# EAGLE design untitled (EAGLE 9.6.2)
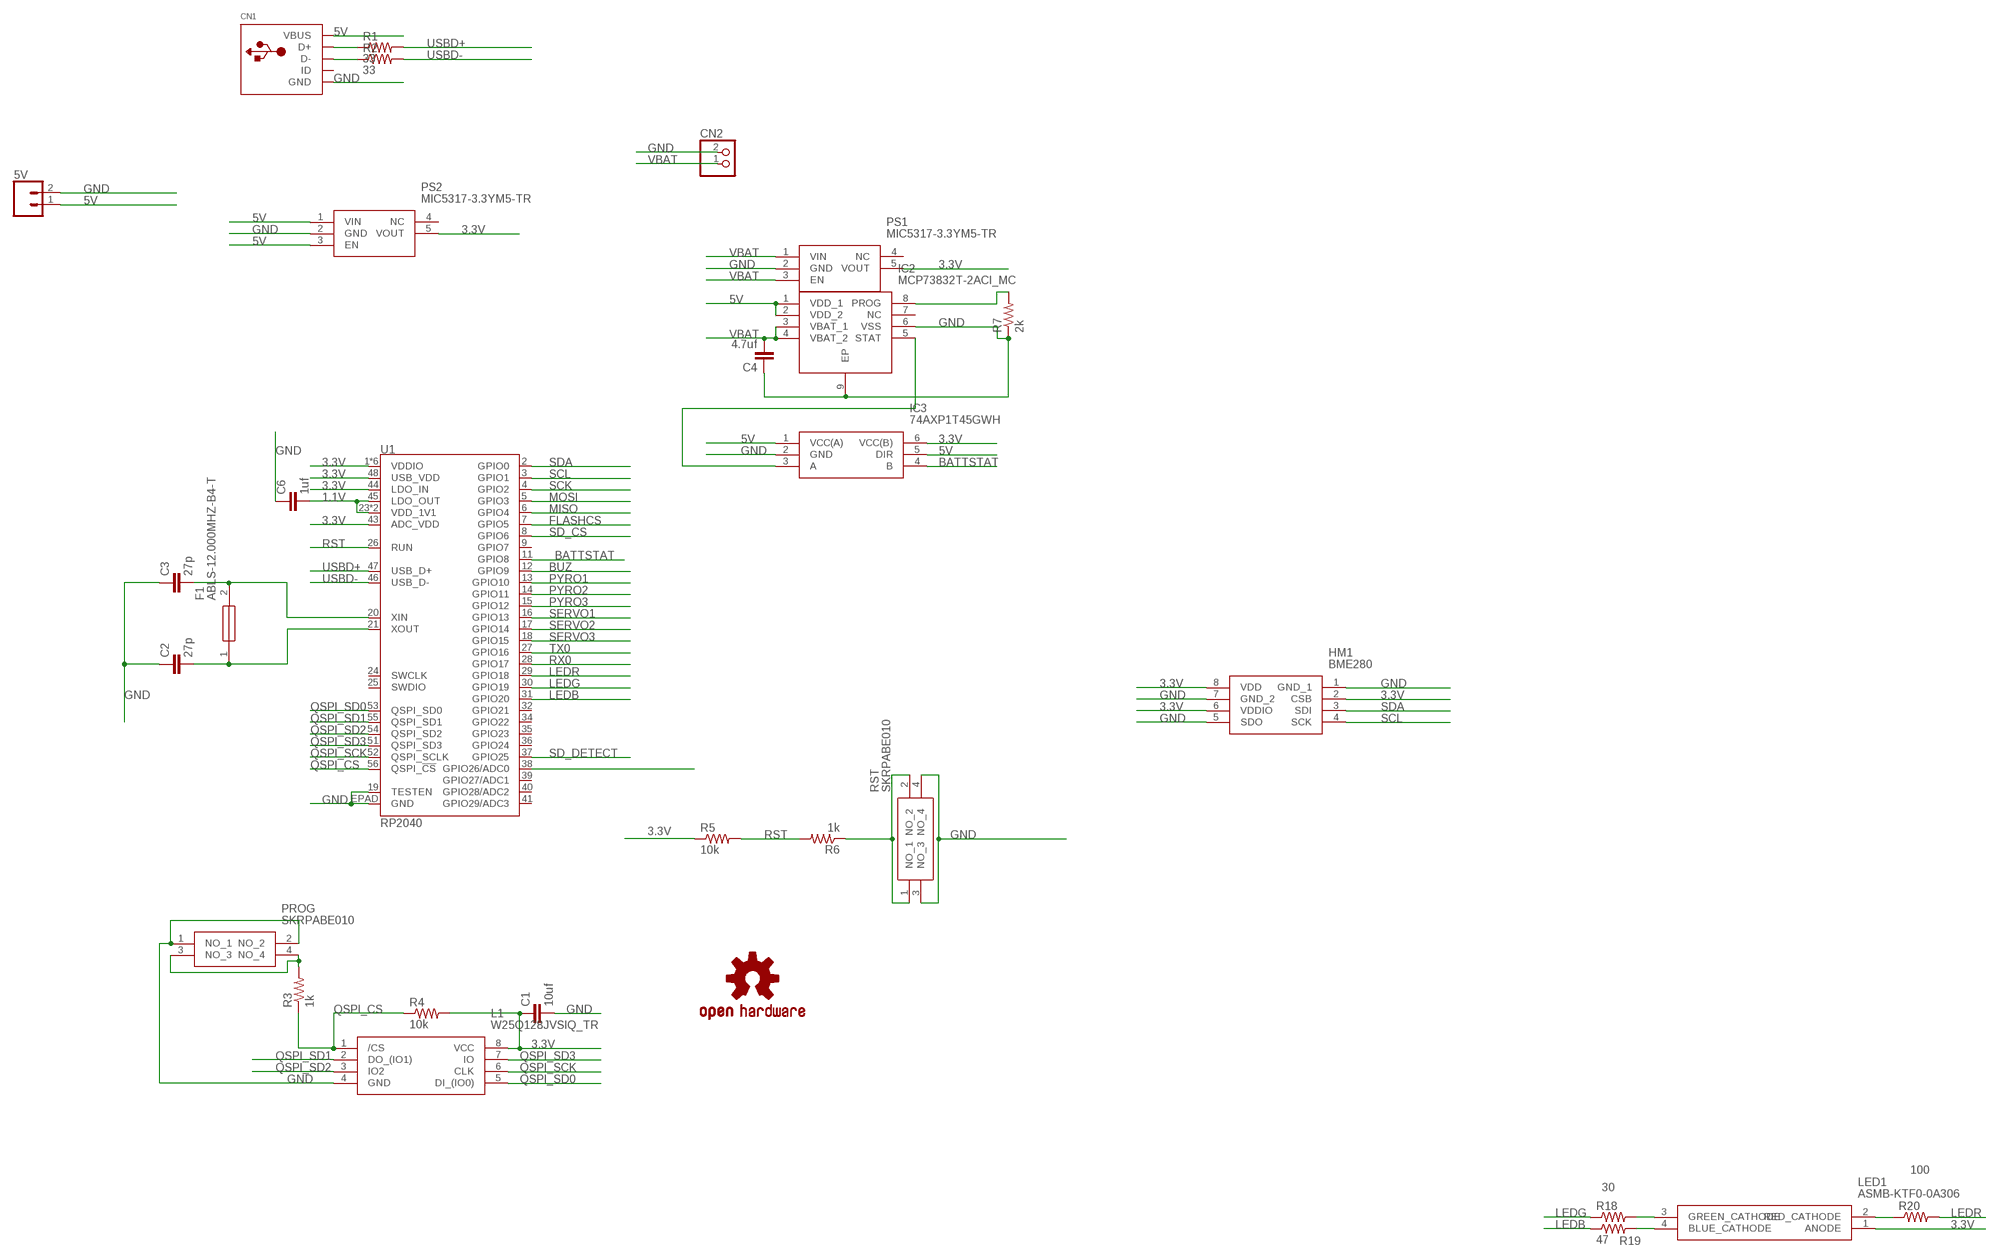
[diagram p0: schematic, sheet 1]

## Parts
5V  CONN_02  [1X02]
C1  10uf  C-EUC0805  [C0805]
C2  27p  C-EUC0805  [C0805]
C3  27p  C-EUC0805  [C0805]
C4  4.7uf  C-EUC0805  [C0805]
C6  1uf  C-EUC0805  [C0805]
CN1  USBMINIB  [USB-MINIB]
CN2  JST_2PIN-SMT-RA  [JST-PH-2-SMT-RA]
F1  ABLS-12.000MHZ-B4-T  [HC/49US-(AT49)_1]
HM1  BME280  [BME280]
IC2  MCP73832T-2ACI_MC  [SON50P300X200X100-9N]
IC3  74AXP1T45GWH  [74AXP1T45GWH]
L1  W25Q128JVSIQ_TR  [SOIC127P780X195-8N]
LED1  ASMB-KTF0-0A306  [ASMBKTF00A306]
LOGO1  OSHW-LOGOS  [OSHW-LOGO-S]
PROG  SKRPABE010  [SKRPABE010]
PS1  MIC5317-3.3YM5-TR  [SOT95P280X145-5N]
PS2  MIC5317-3.3YM5-TR  [SOT95P280X145-5N]
R1  33  R-US_M0805  [M0805]
R2  33  R-US_M0805  [M0805]
R3  1k  R-US_M0805  [M0805]
R4  10k  R-US_M0805  [M0805]
R5  10k  R-US_M0805  [M0805]
R6  1k  R-US_M0805  [M0805]
R7  2k  R-US_M0805  [M0805]
R18  30  R-US_M0805  [M0805]
R19  47  R-US_M0805  [M0805]
R20  100  R-US_M0805  [M0805]
RST  SKRPABE010  [SKRPABE010]
U1  RP2040  [QFN-56]

## Nets
1.1V: C6.2 U1.23(VDD_1V1) U1.45(LDO_OUT) U1.50(VDD_1V1)
3.3V: C1.1 HM1.2(CSB) HM1.6(VDDIO) HM1.8(VDD) IC3.6(VCC(B)) L1.8(VCC) LED1.1(ANODE) PS1.5(VOUT) PS2.5(VOUT) R4.2 R5.1 U1.1(VDDIO) U1.10(VDDIO) U1.22(VDDIO) U1.33(VDDIO) U1.42(VDDIO) U1.43(ADC_VDD) U1.44(LDO_IN) U1.48(USB_VDD) U1.49(VDDIO)
5V: 5V.1 CN1.VBUS IC2.1(VDD_1) IC2.2(VDD_2) IC3.1(VCC(A)) IC3.5(DIR) PS2.1(VIN) PS2.3(EN)
BATTSTAT: IC3.4(B) U1.11(GPIO8)
BUZ: U1.12(GPIO9)
FLASHCS: U1.7(GPIO5)
GND: 5V.2 C1.2 C2.1 C3.1 C4.1 C6.1 CN1.GND CN2.2 HM1.1(GND_1) HM1.5(SDO) HM1.7(GND_2) IC2.6(VSS) IC2.9(EP) IC3.2(GND) L1.4(GND) PROG.1(NO_1) PROG.2(NO_2) PS1.2(GND) PS2.2(GND) R7.1 RST.3(NO_3) RST.4(NO_4) U1.19(TESTEN) U1.EPAD(GND)
LEDB: R19.1 U1.31(GPIO20)
LEDG: R18.1 U1.30(GPIO19)
LEDR: R20.2 U1.29(GPIO18)
MISO: U1.6(GPIO4)
MOSI: U1.5(GPIO3)
N$1: IC2.8(PROG) R7.2
N$2: PROG.3(NO_3) PROG.4(NO_4) R3.2
N$3: IC2.5(STAT) IC3.3(A)
N$4: R6.1 RST.1(NO_1) RST.2(NO_2)
N$5: CN1.D+ R1.1
N$6: CN1.D- R2.1
N$18: C3.2 F1.2 U1.20(XIN)
N$19: C2.2 F1.1 U1.21(XOUT)
N$23: LED1.3(GREEN_CATHODE) R18.2
N$24: U1.38(GPIO26/ADC0)
N$25: LED1.4(BLUE_CATHODE) R19.2
N$26: LED1.2(RED_CATHODE) R20.1
PYRO1: U1.13(GPIO10)
PYRO2: U1.14(GPIO11)
PYRO3: U1.15(GPIO12)
QSPI_CS: L1.1(/CS) R3.1 R4.1 U1.56(QSPI_!CS!)
QSPI_SCK: L1.6(CLK) U1.52(QSPI_SCLK)
QSPI_SD0: L1.5(DI_(IO0)) U1.53(QSPI_SD0)
QSPI_SD1: L1.2(DO_(IO1)) U1.55(QSPI_SD1)
QSPI_SD2: L1.3(IO2) U1.54(QSPI_SD2)
QSPI_SD3: L1.7(IO) U1.51(QSPI_SD3)
RST: R5.2 R6.2 U1.26(RUN)
RX0: U1.28(GPIO17)
SCK: U1.4(GPIO2)
SCL: HM1.4(SCK) U1.3(GPIO1)
SD_CS: U1.8(GPIO6)
SD_DETECT: U1.37(GPIO25)
SDA: HM1.3(SDI) U1.2(GPIO0)
SERVO1: U1.16(GPIO13)
SERVO2: U1.17(GPIO14)
SERVO3: U1.18(GPIO15)
TX0: U1.27(GPIO16)
USBD+: R1.2 U1.47(USB_D+)
USBD-: R2.2 U1.46(USB_D-)
VBAT: C4.2 CN2.1 IC2.3(VBAT_1) IC2.4(VBAT_2) PS1.1(VIN) PS1.3(EN)
Unconnected: CN1.ID IC2.7(NC) PS1.4(NC) PS2.4(NC) U1.9(GPIO7) U1.24(SWCLK) U1.25(SWDIO) U1.32(GPIO21) U1.34(GPIO22) U1.35(GPIO23) U1.36(GPIO24) U1.39(GPIO27/ADC1) U1.40(GPIO28/ADC2) U1.41(GPIO29/ADC3)

## Library data of the parts
5V = SparkFun-Connectors:CONN_02: Multi connection point. Often used as Generic Header-pin footprint for 0.1 inch spaced/style header connections On any of the 0.1 inch spaced packages, you can populate with these: Break Away Headers - Straight <https://www.sparkfun.com/products/116> (PRT-00116) Break Away Male Headers - Right Angle <https://www.sparkfun.com/products/553> (PRT-00553) Female Headers <https://www.sparkfun.com/products/115> (PRT-00115) Break Away Headers - Machine Pin <https://www.sparkfun.com/products/117> (PRT-00117) Break Away Female Headers - Swiss Machine Pin <https://www.sparkfun.com/products/743> (PRT-00743) For SCREWTERMINALS and SPRING TERMINALS visit here: Screw Terimnals on SparkFun.com <https://www.sparkfun.com/search/results?term=Screw+Terminals> (5mm/3.5mm/2.54mm spacing) This device is also useful as a general connection point to wire up your design to another part of your project. Our various solder wires solder well into these plated through hole pads. Hook-Up Wire - Assortment (Stranded, 22 AWG) <https://www.sparkfun.com/products/11375> (PRT-11375) Hook-Up Wire - Assortment (Solid Core, 22 AWG) <https://www.sparkfun.com/products/11367> (PRT-11367) View the entire wire category on our website here <https://www.sparkfun.com/categories/141> Special notes: Molex polarized connector foot print use with: PRT-08233 with associated crimp pins and housings. 2.54_SCREWTERM for use with PRT-10571. 3.5mm Screw Terminal footprints for PRT-08084 5mm Screw Terminal footprints for use with PRT-08432
C1-C4 C6 = rcl:C-EU: CAPACITOR, European symbol; SPICEPREFIX: C
CN1 = adafruit:USB: USB Connectors USBMINIB - Surface Mount Female Mini-B USB Connector 4UConnector: 06564 By microbuilder.eu Thru-hole RA Female Mini-B USB Connector 4UConnector: 18732 By ladyada.net
CN2 = adafruit:JST_2PIN: JST 2-Pin Connectors of various flavors SMT-RA (S2B-PH-SM4) 4UConnector #17311 SMT (B2B-PH-SM4) THM-RA (S2B-PH) THM (B2B-PH)
F1 = ABLS-12.000MHZ-B4-T:ABLS-12.000MHZ-B4-T: ABRACON - ABLS-12.000MHZ-B4-T - CRYSTAL, 12MHZ, 18PF, HC-49US Source: Datasheet <https://componentsearchengine.com/Datasheets/2/ABLS-12.000MHZ-B4-T.pdf>; DESCRIPTION: ABRACON - ABLS-12.000MHZ-B4-T - CRYSTAL, 12MHZ, 18PF, HC-49US; HEIGHT: mm; MANUFACTURER_NAME: ABRACON; MANUFACTURER_PART_NUMBER: ABLS-12.000MHZ-B4-T; MOUSER_PART_NUMBER: 815-ABLS-12.0M-T; MOUSER_PRICE-STOCK: https://www.mouser.co.uk/ProductDetail/ABRACON/ABLS-12.000MHZ-B4-T?qs=yTU0IcKoRlGSQ8ooxPPVnQ%3D%3D
HM1 = BME280:BME280: Board Mount Humidity Sensors Source: Datasheet <https://datasheet.datasheetarchive.com/originals/distributors/DKDS-24/462906.pdf>; DESCRIPTION: Board Mount Humidity Sensors; HEIGHT: mm; MANUFACTURER_NAME: BOSCH; MANUFACTURER_PART_NUMBER: BME280; MOUSER_PART_NUMBER: 262-BME280; MOUSER_PRICE-STOCK: https://www.mouser.co.uk/ProductDetail/Bosch-Sensortec/BME280?qs=2OnyuXx6vpj2fK9HX7qb3g%3D%3D
IC2 = MCP73832T-2ACI_MC:MCP73832T-2ACI_MC: Miniature Single-Cell, Fully Integrated Li-Ion, Li-Polymer Charge Management Controllers Source: Datasheet <http://ww1.microchip.com/downloads/en/DeviceDoc/20001984g.pdf>; DESCRIPTION: Miniature Single-Cell, Fully Integrated Li-Ion, Li-Polymer Charge Management Controllers; HEIGHT: 1mm; MANUFACTURER_NAME: Microchip; MANUFACTURER_PART_NUMBER: MCP73832T-2ACI/MC; MOUSER_PART_NUMBER: 579-MCP73832T-2ACIMC; MOUSER_PRICE-STOCK: https://www.mouser.co.uk/ProductDetail/Microchip-Technology-Atmel/MCP73832T-2ACI-MC?qs=yUQqVecv4qsHSZ5q80S33Q%3D%3D
IC3 = 74AXP1T45GWH:74AXP1T45GWH: Translation - Voltage Levels DUAL SUPPLY TRANSLATING TRNSVR Source: Datasheet <https://assets.nexperia.com/documents/data-sheet/74AXP1T45.pdf>; DESCRIPTION: Translation - Voltage Levels DUAL SUPPLY TRANSLATING TRNSVR; HEIGHT: 1.1mm; MANUFACTURER_NAME: Nexperia; MANUFACTURER_PART_NUMBER: 74AXP1T45GWH; MOUSER_PART_NUMBER: 771-74AXP1T45GWH; MOUSER_PRICE-STOCK: https://www.mouser.co.uk/ProductDetail/Nexperia/74AXP1T45GWH?qs=W%2FMpXkg%252BdQ7qdQ26rLqoCg%3D%3D
L1 = W25Q128JVSIQ_TR:W25Q128JVSIQ_TR: FLASH - NOR Memory IC 128Mb (16M x 8) SPI - Quad I/O 8-SOIC Source: Datasheet <http://www.winbond.com/resource-files/w25q128jv spi revc 11162016.pdf>; DESCRIPTION: FLASH - NOR Memory IC 128Mb (16M x 8) SPI - Quad I/O 8-SOIC; HEIGHT: 1.95mm; MANUFACTURER_NAME: Winbond; MANUFACTURER_PART_NUMBER: W25Q128JVSIQ TR; MOUSER_PART_NUMBER: 454-W25Q128JVSIQTR; MOUSER_PRICE-STOCK: https://www.mouser.co.uk/ProductDetail/Winbond/W25Q128JVSIQ-TR?qs=qSfuJ%252Bfl%2Fd7vTyLA9kNdGw%3D%3D
LED1 = ASMB-KTF0-0A306:ASMB-KTF0-0A306: Standard LEDs - SMD 2220 PLCC4 Tricolor Source: Datasheet <https://componentsearchengine.com/Datasheets/1/ASMB-KTF0-0A306.pdf>; DESCRIPTION: Standard LEDs - SMD 2220 PLCC4 Tricolor; HEIGHT: 2.1mm; MANUFACTURER_NAME: Avago Technologies; MANUFACTURER_PART_NUMBER: ASMB-KTF0-0A306; MOUSER_PART_NUMBER: 630-ASMB-KTF0-0A306; MOUSER_PRICE-STOCK: https://www.mouser.co.uk/ProductDetail/Broadcom-Avago/ASMB-KTF0-0A306?qs=j%252B1pi9TdxUYIaJsf%252B0lh6A%3D%3D
LOGO1 = SparkFun-Aesthetics:OSHW-LOGO: Open-Source Hardware (OSHW) Logo This logo indicates the piece of hardware it is found on incorporates a OSHW license and/or adheres to the definition of open source hardware found here: http://freedomdefined.org/OSHW
PROG RST = SKRPABE010:SKRPABE010: Switch Tactile N.O. SPST Button J-Bend 0.05A 16VDC 1.57N SMD Automotive T/R Source: Datasheet <https://datasheet.lcsc.com/szlcsc/ALPS-Electric-SKRPABE010_C115360.pdf>; DESCRIPTION: Switch Tactile N.O. SPST Button J-Bend 0.05A 16VDC 1.57N SMD Automotive T/R; HEIGHT: 2.5mm; MANUFACTURER_NAME: ALPS Electric; MANUFACTURER_PART_NUMBER: SKRPABE010; MOUSER_PART_NUMBER: 688-SKRPAB; MOUSER_PRICE-STOCK: https://www.mouser.co.uk/ProductDetail/Alps-Alpine/SKRPABE010?qs=m0BA540hBPe1GpcSf%2FZ5Yw%3D%3D
PS1 PS2 = MIC5317-3.3YM5-TR:MIC5317-3.3YM5-TR: MICROCHIP - MIC5317-3.3YM5-TR - LDO, FIXED, 3.3V, 0.15A, -40 TO 125DEG C Source: Datasheet <http://ww1.microchip.com/downloads/en/devicedoc/mic5317.pdf>; DESCRIPTION: MICROCHIP - MIC5317-3.3YM5-TR - LDO, FIXED, 3.3V, 0.15A, -40 TO 125DEG C; HEIGHT: 1.45mm; MANUFACTURER_NAME: Microchip; MANUFACTURER_PART_NUMBER: MIC5317-3.3YM5-TR; MOUSER_PART_NUMBER: 998-MIC5317-3.3YM5TR; MOUSER_PRICE-STOCK: https://www.mouser.co.uk/ProductDetail/Microchip-Technology-Atmel/MIC5317-3.3YM5-TR?qs=U6T8BxXiZAUR0BSg3XdMLw%3D%3D
R1-R7 R18-R20 = resistor:R-US_: RESISTOR, American symbol
U1 = SparkFun-IC-Microcontroller:RP2040: Raspberry Pi RP2040 MCU 56-pin 32-bit Microcontroller with 264kB of SRAM and external flash support up to 16MB Getting Started with the RP2040 <https://pico.raspberrypi.org/getting-started/> Dual-core ARM Cortex M0+ processor, flexible clock running up to 133 MHz 264kB of SRAM, and QSPI control of common flash memory USB 1.1 Host and Device support Low-power sleep and dormant modes Drag & drop programming using mass storage over USB 26 multi-function GPIO pins 2×SPI, 2×I2C, 2×UART, 3×12-bit ADC, 16×controllable PWM channels Accurate clock and timer on-chip Temperature sensor Accelerated floating point libraries on-chip 8×Programmable IO (PIO) state machines for custom peripheral support; PROD_ID: IC-15502

## Board
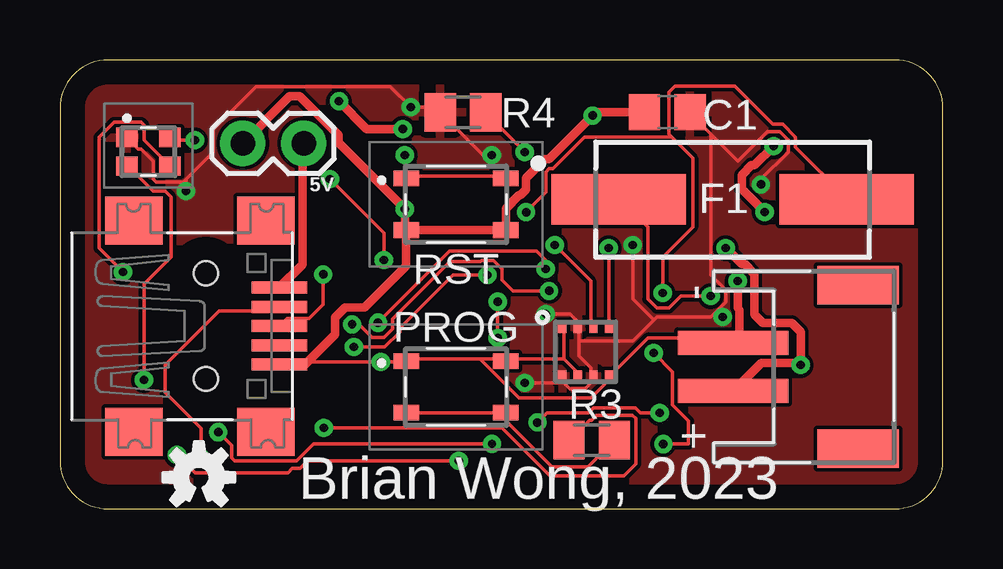
[diagram p1: board, top side]
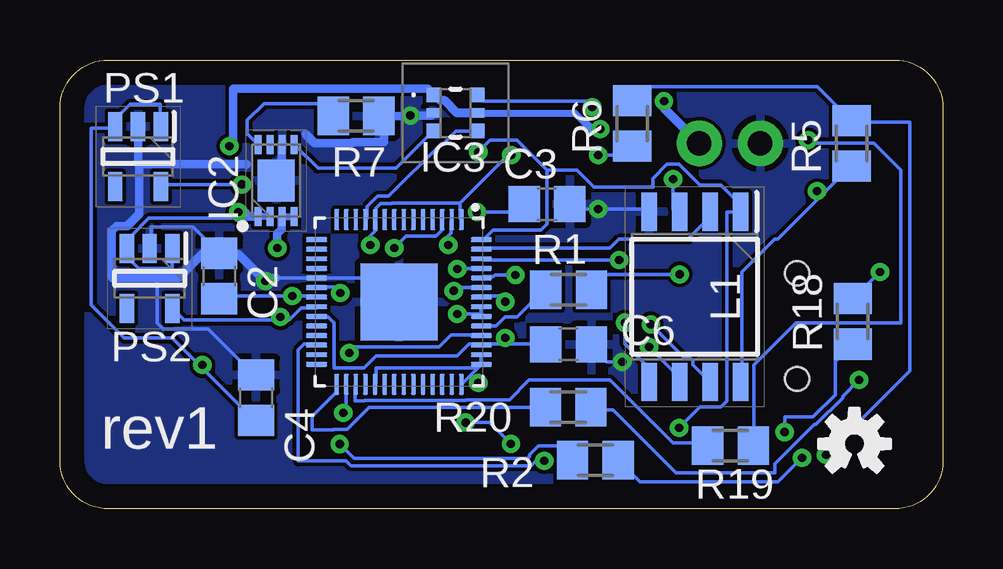
[diagram p2: board, bottom side, seen from below]

Size 36.81 x 18.72 mm. Coordinates in mm from the lower left corner, seen from the top.
Outline: 0,16.72 0,2 arc90 2,0 34.81,0 arc90 36.81,2 36.81,16.72 arc90 34.81,18.72 2,18.72 arc90 0,16.72
Copper layers (1*16): Top 0.035mm / dielectric 1.5mm / Bottom 0.035mm
Design rules "default *": minimum track width 6mil, minimum drill 0.35mm, track to track 6mil, track to pad 6mil, pad to pad 6mil, via to via 6mil, smd to smd 6mil, copper to edge 40mil, drill to drill 6mil, minimum pad ring 10mil, minimum via ring 8mil, stop-mask expansion 4mil, vias tented up to drill 15mil, thermal gap 10mil

### Footprints (pad centres in the part's own frame; a part is rotated, then mirrored left to right if it is on the bottom)
1X02 = drill 1.016 pad 1.88: 1 0,0; 2 2.54,0
C0805 = smd 1.3 x 1.5: 1 -0.95,0; 2 0.95,0
USB-MINIB = smd 0.5 x 2.308: D+ 0,4.064; D- -0.8,4.064; GND 1.6,4.064; ID 0.8,4.064; VBUS -1.6,4.064 | smd 2 x 2.4: GND1 -4.4,-2; GND2 -4.4,3.5; GND3 4.4,3.5; GND4 4.4,-2 | hole 1: -2.2,1; 2.2,1
JST-PH-2-SMT-RA = smd 1 x 4.6: 1 1,-3.7; 2 -1,-3.7 | smd 1.6 x 3.4: NC1 -3.4,1.5; NC2 3.4,1.5
HC/49US-(AT49)_1 = smd 5.6 x 2.1: 1 -4.75,0; 2 4.75,0
BME280 = smd 0.5 x 0.35: 1 2.05,0; 2 2.05,-0.65; 3 2.05,-1.3; 4 2.05,-1.95; 5 0,-1.95; 6 0,-1.3; 7 0,-0.65; 8 0,0
SON50P300X200X100-9N = smd 0.8 x 0.3: 1 -1.5,0.75; 2 -1.5,0.25; 3 -1.5,-0.25; 4 -1.5,-0.75; 5 1.5,-0.75; 6 1.5,-0.25; 7 1.5,0.25; 8 1.5,0.75 | smd 1.75 x 1.55: 9 0,0
74AXP1T45GWH = smd 0.6 x 0.6: 1 -0.9,0.75; 3 -0.9,-0.75; 4 0.9,-0.75; 6 0.9,0.75 | smd 0.6 x 0.4: 2 -0.9,0; 5 0.9,0
SOIC127P780X195-8N = smd 1.6 x 0.65: 1 -3.55,1.905; 2 -3.55,0.635; 3 -3.55,-0.635; 4 -3.55,-1.905; 5 3.55,-1.905; 6 3.55,-0.635; 7 3.55,0.635; 8 3.55,1.905
ASMBKTF00A306 = smd 0.9 x 0.8: 1 0.9,-0.6; 2 0.9,0.6; 3 -0.9,0.6; 4 -0.9,-0.6
SKRPABE010 = smd 1.05 x 0.65: 1 -2.075,1.075; 2 2.075,1.075; 3 -2.075,-1.075; 4 2.075,-1.075
SOT95P280X145-5N = smd 1.2 x 0.6: 1 -1.25,0.95; 2 -1.25,0; 3 -1.25,-0.95; 4 1.25,-0.95; 5 1.25,0.95
M0805 = smd 1.3 x 1.6: 1 -0.95,0; 2 0.95,0
QFN-56 = smd 0.875 x 0.2: 1 -3.437,2.6; 2 -3.437,2.2; 3 -3.437,1.8; 4 -3.437,1.4; 5 -3.437,1; 6 -3.437,0.6; 7 -3.437,0.2; 8 -3.437,-0.2; 9 -3.437,-0.6; 10 -3.437,-1; 11 -3.437,-1.4; 12 -3.437,-1.8; 13 -3.437,-2.2; 14 -3.437,-2.6; 29 3.437,-2.6; 30 3.437,-2.2; 31 3.437,-1.8; 32 3.437,-1.4; 33 3.437,-1; 34 3.437,-0.6; 35 3.437,-0.2; 36 3.437,0.2; 37 3.437,0.6; 38 3.437,1; 39 3.437,1.4; 40 3.437,1.8; 41 3.437,2.2; 42 3.437,2.6 | smd 0.2 x 0.875: 15 -2.6,-3.437; 16 -2.2,-3.437; 17 -1.8,-3.437; 18 -1.4,-3.437; 19 -1,-3.437; 20 -0.6,-3.437; 21 -0.2,-3.437; 22 0.2,-3.437; 23 0.6,-3.437; 24 1,-3.437; 25 1.4,-3.437; 26 1.8,-3.437; 27 2.2,-3.437; 28 2.6,-3.437; 43 2.6,3.437; 44 2.2,3.437; 45 1.8,3.437; 46 1.4,3.437; 47 1,3.437; 48 0.6,3.437; 49 0.2,3.437; 50 -0.2,3.437; 51 -0.6,3.437; 52 -1,3.437; 53 -1.4,3.437; 54 -1.8,3.437; 55 -2.2,3.437; 56 -2.6,3.437 | smd 3.2 x 3.2: EPAD 0,0

### Placement (x,y rotation side)
5V  10.16,15.24 180 top
C1  25.32,16.54 180 top
C2  30.17,9.71 270 bottom
C3  16.51,12.7 180 bottom
C4  28.63,4.64 270 bottom
C6  15.61,6.86 180 bottom
CN1  5.08,7.62 270 top
CN2  31.77,5.92 270 top
F1  28.04,12.9 0 top
HM1  20.94,5.52 90 top
IC2  27.8,13.69 90 bottom
IC3  20.32,16.51 0 bottom
L1  10.35,8.84 270 bottom
LED1  3.69,14.89 180 top
LOGO1  5.79,1.31 0 top
LOGO2  OSHW-LOGOS  [OSHW-LOGO-S]  3.69,2.71 0 bottom
PROG  16.51,5.08 0 top
PS1  33.56,14.69 270 bottom
PS2  33.07,9.61 270 bottom
R1  15.61,9.14 180 bottom
R2  14.49,2.03 180 bottom
R3  22.17,2.87 0 top
R4  16.8,16.54 180 top
R5  3.81,15.24 90 bottom
R6  12.96,16.07 90 bottom
R7  24.47,16.39 180 bottom
R18  3.76,7.82 90 bottom
R19  8.86,2.64 0 bottom
R20  15.62,4.24 180 bottom
RST  16.51,12.7 0 top
U1  22.68,8.63 270 bottom

### Tracks (layer width: path | path; a pad name or v marks a point on that pad's centre or on a via)
1.1V  (via drill 0.35)
  Top 0.152: v18.25,8.63 v18.25,7.13 v18.25,7.12
  Bottom 0.152: 18.25,6.88 16.62,6.88 C6.2 | 18.25,6.88 19.12,6.88 U1.45 19.25,6.88 19.75,6.88 20.25,6.38 23.62,6.38 24.12,5.88 25.38,5.88 25.38,7.75 25.62,8 26,8 U1.23 | v18.25,8.63 18.49,8.88 19.12,8.88 U1.50 | 18.25,6.88 v18.25,7.12
3.3V  (via drill 0.35)
  Top 0.152: 21,5.25 21,5.5 HM1.8 | 21,5.25 21.25,5 21.88,5 22.12,5.25 22.12,5.5 HM1.6 22.12,5.62 22.12,5.88 21.62,6.38 21.62,7 | 21.62,7 21.62,7.5 HM1.2 21.5,7.62 21.5,7.88 21.25,8.12 v20.25,8.12 | 27.12,15.62 26.25,16.5 C1.1 | 21.62,7 23.88,7 24.75,7.88 | 24.75,7.88 24.88,8 27.12,8 27.38,8.25 | 27.38,8.25 27.75,8.62 27.75,9.12 27.12,9.75 27.12,15.62 | 21,5.25 v19.38,5.25 | 27.38,8.25 v27.62,8 | 5.25,13.75 6.38,14.88 6.38,15.81 8.18,17.61 13.77,17.61 v14.62,16.75 15.62,16.75 15.75,16.62 R4.2 15.88,16.5 17.62,14.75 v18,14.75 | 5.25,13.75 5.12,13.62 4,13.62 3.88,13.75 3.88,14.5 3.38,15 3.25,15 2.88,15.38 LED1.1 | 5.25,13.75 v5.25,13.25 | 24.75,7.88 23.88,8.75 v23.88,11 | 27.12,15.62 28.26,14.49 29.5,15.73 30,15.73 30.36,15.38 30.36,14.87 29.23,13.74 v29.23,13.53
  Bottom 0.152: 27.62,7.88 31.62,7.88 32,8.25 PS2.5 | 27.62,7.88 27.25,7.88 26.75,8.38 26.12,8.38 U1.22 | U1.44 19.25,6.38 19.25,6.12 U1.43 19.25,6 19.38,5.88 | 19.38,5.88 19.75,5.5 | 19.75,5.5 20,5.25 U1.42 | 19.38,5.88 23.62,5.88 23.62,5.25 U1.33 | 19.25,8.12 19.25,8.38 U1.49 | v20.25,8.12 19.25,8.12 | 19.25,8.12 U1.48 | v29.23,13.53 32.48,13.53 32.5,13.5 PS1.5 | 19.75,5.5 19.5,5.25 v19.38,5.25 | v27.62,8 27.62,7.88 | 5,13.12 6.88,11.25 7,11.25 8.38,9.88 8.38,5.38 L1.8 | 5,13.12 3.88,14.25 R5.1 | 20.12,12.75 20.12,12.12 U1.1 | v14.62,16.75 14.88,17 19.12,17 19.38,17.25 IC3.6 | 20.12,12.75 18.12,14.75 v18,14.75 | 5,13.12 5.12,13.25 v5.25,13.25 | v23.88,11 23.88,11.38 23.62,11.62 23.62,12 U1.10 23.62,12.12 23.62,12.55 23.45,12.73 22.98,12.73 22.96,12.75 20.12,12.75
  pour Top: -2.2,20.6 -2.2,-1.7 -0.3,-3.6 36.3,-3.6 40,0.1 40,17 35.9,21.1 -1.7,21.1
5V  (via drill 0.35, 0.35 pad 0.76)
  Top 0.35: v29.38,12.38 28.42,13.33 28.42,13.92 28.83,14.33 28.96,14.33 v29.75,15.12 | v14.29,15.84 12.79,15.84 v11.63,17 | 5V.1 10.11,15.19 10.11,10.19 CN1.VBUS
  Bottom 0.152: PS2.1 32.12,10.75 32.12,10.03 33.53,10.03 34,10.5 34,10.75 PS2.3 34,10.88 34,11.25 33.87,11.38 33.84,11.38 33.1,12.12 29.38,12.12 | IC3.5 19.5,16.62 20.5,16.62 21.12,17.25 21.19,17.26 IC3.1 21.25,17.38
  Bottom 0.3: IC3.5 15.35,16.51 14.84,16 | IC2.2 IC2.1 | v29.38,12.38 29.04,12.38
  Bottom 0.35: v29.75,15.12 29.6,15.28 29.6,17.52 21.46,17.52 21.22,17.28 IC3.1 21,17.04 20.78,17.04 20.26,16.51 IC3.5 | 14.84,16 14.68,15.84 v14.29,15.84 | v11.63,17 11.63,16.71 5V.1 | 29.38,12.12 v29.38,12.38 29.19,12.19 IC2.1
BATTSTAT
  Bottom 0.152: U1.11 24,12.14 24,12.6 23.57,13.04 23.11,13.04 20.91,15.23 20.82,15.23 20.3,15.76 IC3.4
GND  (via drill 0.35, 0.35 pad 0.76)
  Top 0.152: CN2.2 28,7 27.88,7.12 24.5,7.12 23,5.62 HM1.5 22.88,5.5 22.88,5.38 22.12,4.62 19.12,4.62 17.5,6.25 | RST.4 RST.3 14.38,11.62 v14.38,12.5 | 21,6.25 21,7.5 HM1.1 | 21,6.25 21.62,5.62 HM1.7 | 17.5,6.25 18.5,6.25 PROG.2 18.62,6.25 21,6.25 | 17.5,6.25 14.5,6.25 PROG.1 14.38,6.12 v13.38,6.12 9.25,6.12 CN1.GND
  Top 0.35: v28.25,9.5 28.25,8.37 28.33,8.29 28.33,7.18 CN2.2 | 14.38,11.62 RST.4 18.59,12.53 19.14,13.08 19.2,13.08 19.44,13.31 19.44,13.79 20.23,14.58 20.38,14.58 v22.2,16.4 22.34,16.54 C1.2 | CN1.GND 10.21,6.02 11.47,7.28 11.47,7.98 11.89,8.4 12.7,8.4 14.44,10.13 RST.3 14.38,11.69 v14.38,12.5 11.61,15.26 11.61,15.58 9.99,17.2 9.58,17.2 5V.2
  Bottom 0.152: 29,14.38 29.03,14.38 33.5,14.38 33.5,14.4 33.5,15.88 PS1.2 | U1.EPAD 22.75,8.75 23.62,9.62 26,9.62 U1.19 26.12,9.62 27.8,9.62 28.25,9.62 | 30.5,11 30.25,10.75 C2.1 | 30.5,11 31.25,11.75 33,11.75 33,10.88 PS2.2 | 32.75,9.62 32.75,7.75 32.5,7.5 30.62,7.5 28.75,5.62 C4.1 | 32.75,9.62 31.88,9.62 30.5,11 | 30.5,11 C2.1 | 30.12,10.62 C2.1 | 32.75,9.62 34.62,9.62 | C3.1 15.5,12.62 15.38,12.5 v14.38,12.5 12.38,12.5 L1.4 | v13.38,6.12 14,6.12 14.62,6.75 C6.1 | 23.5,16.4 R7.1
  Bottom 0.35: 30.12,10.62 29.38,10.62 v28.25,9.5 28.12,9.62 27.8,9.62 | C2.1 30.84,10.66 31.88,9.62 34.62,9.62 34.62,10.1 34.65,10.12 34.65,11.6 34.46,11.79 34.01,11.79 33.5,12.3 33.5,14.38 | 29.03,14.35 29.03,14.38 33.48,14.38 33.5,14.4 33.56,14.46 PS1.2 | IC2.9 28.05,13.44 28.06,13.44 | 27.55,13.94 IC2.9 | 27.53,15.21 IC2.6 27.57,15.17 27.57,14.35 27.8,14.13 IC2.9 | 26.56,15.62 26.2,15.26 24.63,15.26 24.59,15.3 23.3,15.3 23.3,16.2 23.5,16.4 | R7.1 22.21,16.39 v22.2,16.4 21.33,16.4 IC3.2
  pour Bottom: -3.3,22.7 -3.3,-3.3 -3,-3.6 -1.8,-4.8 -0.2,-4.8 38.9,-4.8 42.1,-1.6 42.1,17.8 37.6,22.3 37.2,22.7
LEDB
  Bottom 0.152: U1.31 24.5,5.12 24.5,4.5 24.14,4.5 24.11,4.53 19.91,4.53 19.89,4.54 18.08,4.54 17.25,5.38 13.88,5.38 11.25,2.75 9.88,2.75 R19.1
LEDG  (via drill 0.35 pad 0.76)
  Top 0.152: v6.6,3.2 7.15,2.65 7.15,2.12 7.29,1.99 9.88,1.99 10.58,2.7 v18,2.7 v18.01,2.71 | v19.9,3.6 20.3,4 22.04,4 22.24,4.21 23.99,4.21 24.19,4 v25,4
  Bottom 0.152: v6.6,3.2 6.6,3.83 5.42,3.83 4.49,4.76 4.49,6.14 R18.1 | v18.01,2.71 18.9,3.6 v19.9,3.6 | v25,4 24.88,4.12 U1.30
LEDR
  Bottom 0.152: U1.29 25.25,5.12 25.25,4.9 26.3,3.85 26.3,3.3 25.41,3.3 25.4,3.31 25.23,3.31 25.21,3.32 25.2,3.31 24.84,3.31 23.92,4.22 19.78,4.22 19.76,4.24 R20.2
N$1
  Bottom 0.152: IC2.8 29,15.64 29,16.2 28.3,16.9 25.93,16.9 R7.2
N$2
  Top 0.152: 18.25,4 18.5,4 PROG.4 18.25,4 | 18.25,4 14.5,4 PROG.3 | 18.25,4 20.5,1.75 22,1.75 23,2.75 R3.2
N$3
  Bottom 0.152: IC3.3 21.25,15.75 22.8,14.2 26.06,14.2 IC2.5
N$4  (via drill 0.35)
  Top 0.152: RST.2 18.5,13.88 14.5,13.88 RST.1 14.38,13.88 v14.38,14.75
  Bottom 0.152: v14.38,14.75 13.25,14.75 13,15 R6.1
N$5  (via drill 0.35)
  Top 0.152: CN1.D+ 9.46,7.94 10.39,7.94 10.97,8.52 v10.97,9.78
  Bottom 0.152: v10.97,9.78 13.24,9.78 13.25,9.77 14.03,9.77 R1.1
N$6  (via drill 0.35)
  Top 0.152: v5.88,2.12 5.88,3.35 4.38,4.85 4.38,6 6.62,8.25 9,8.25 9.12,8.38 CN1.D-
  Bottom 0.152: v5.88,2.12 6.88,1.12 12.62,1.12 13.5,2 R2.1
N$18  (via drill 0.35)
  Top 0.152: v25.12,9 25.12,10.5 26.38,11.75 26.38,14.62 25.5,15.5 | 25.5,15.5 25.38,15.62 25.38,17.38 25.62,17.62 28.12,17.62 29.71,16.04 30.13,16.04 30.66,15.5 30.66,15.09 32.75,13 F1.2 | v19.43,12.37 20.26,13.2 20.26,14.04 20.39,14.18 20.55,14.18 21.87,15.5 25.5,15.5
  Bottom 0.152: v25.12,9 25.38,9.25 26,9.25 U1.20 | C3.2 17.79,12.37 v19.43,12.37
N$19  (via drill 0.35)
  Top 0.152: v27.12,8.88 25.88,8.88 25.38,8.38 24.88,8.38 24.5,8.75 24.5,11.75 23.38,12.88 F1.1
  Bottom 0.152: U1.21 26.12,8.88 v27.12,8.88 30.12,8.88 C2.2
N$23  (via drill 0.35)
  Top 0.152: v2.62,9.88 1.62,10.88 1.62,15.5 2.25,16.12 3.38,16.12 3.5,16 3.5,15.38 4.5,14.38 LED1.3
  Bottom 0.152: v2.62,9.88 3.62,8.88 3.75,8.88 R18.2
N$25  (via drill 0.35)
  Top 0.152: v5.62,15.38 4.62,15.38 LED1.4
  Bottom 0.152: v5.62,15.38 5.5,15.25 2.88,15.25 1.75,14.12 1.75,7.75 6.12,7.75 7.88,6 7.88,2.75 R19.2
N$26  (via drill 0.35)
  Top 0.152: v3.5,5.38 3.5,9.38 4.62,10.5 4.62,13 4.38,13.25 3.88,13.25 2.88,14.25 LED1.2
  Bottom 0.152: R20.1 14.62,4.12 13.75,4.12 11.12,1.5 7,1.5 7,1.88 5.35,3.52 5.29,3.52 4.18,4.63 4.18,4.69 v3.5,5.38
QSPI_CS  (via drill 0.35)
  Top 0.152: v11,3.38 18.43,3.38 20.43,1.38 23.5,1.38 24,1.88 24,3.76 23.86,3.9 22.37,3.9 22.16,3.69 22.07,3.69 21.25,2.88 R3.1 | v19.38,14.88 17.75,16.5 R4.1
  Bottom 0.152: 16.5,14.12 16.5,11.88 16.75,11.62 18.75,11.62 19.12,11.25 U1.56 | v11,3.38 10.12,4.25 9.25,4.25 9,4.5 9,12.38 8.5,12.38 L1.1 8.5,12.5 8.5,12.75 9.25,13.5 10.12,13.5 11,14.38 11.5,14.38 12.1,13.78 12.1,13.42 14.56,13.42 15.26,14.12 16.5,14.12 | v19.38,14.88 18.88,15.38 17.75,15.38 16.5,14.12
QSPI_SCK  (via drill 0.35)
  Top 0.152: v17.82,9.75 16.38,9.75 14.17,7.54 14.17,7.38 13.53,6.75 v12.25,6.75
  Bottom 0.152: v12.25,6.75 10.88,5.38 L1.6 | v17.82,9.75 18.68,9.75 18.73,9.7 19.17,9.7 U1.52
QSPI_SD0  (via drill 0.35)
  Top 0.152: v20.25,10 20.25,10.36 19.86,10.75 16.25,10.75 v13.26,7.76
  Bottom 0.152: v13.26,7.76 13.26,6.88 12.38,6 12.38,5.38 L1.5 | U1.53 20.22,10.03 v20.25,10
QSPI_SD1
  Bottom 0.152: U1.55 19.12,10.88 13.88,10.88 13.5,11.25 10.62,11.25 9.75,12.12 9.75,12.38 L1.2
QSPI_SD2  (via drill 0.35)
  Top 0.152: v13.5,10.38 13.5,11.5 v11.25,13.75
  Bottom 0.152: v13.5,10.38 19.12,10.38 U1.54 | v11.25,13.75 11.25,12.5 11,12.5 L1.3
QSPI_SD3  (via drill 0.35 pad 0.76)
  Top 0.152: v20.39,9.09 18.88,9.09 18.43,9.54 18.43,10 18.08,10.36 17.57,10.36 17.54,10.32 16.26,10.32 13.86,7.92 13.86,7.51 13.51,7.16 13.01,7.16 12.47,7.69 v12.18,7.69
  Bottom 0.152: U1.51 20.25,9.23 v20.39,9.09 | v12.18,7.69 10.81,6.32 10.56,6.32 10.43,6.19 10.43,6.01 L1.7
RST  (via drill 0.35)
  Top 0.152: v4.88,2.25 5.62,1.5 9.5,1.5 9.69,1.69 10,1.69 10.31,2 v16.62,2
  Bottom 0.152: v4.88,2.25 1.38,5.75 1.38,16.12 3.75,16.12 R5.2 3.88,16.25 5.23,17.61 12.96,17.61 R6.2 | U1.26 26.12,6.88 26.62,6.88 26.88,6.62 26.88,2 24.88,2 24.68,1.79 17.17,1.79 16.97,2 v16.62,2
SCL  (via drill 0.35)
  Top 0.152: v22.88,10.88 22.88,7.62 HM1.4
  Bottom 0.152: v22.88,10.88 22.38,11.38 21.12,11.38 20.88,11.62 20.88,12 U1.3
SDA  (via drill 0.35)
  Top 0.152: v20.62,11 22.12,9.5 22.12,7.62 HM1.3
  Bottom 0.152: v20.62,11 20.62,11.38 20.5,11.5 20.5,12 U1.2
USBD+
  Bottom 0.152: U1.47 19.12,7.62 18.62,7.62 18.25,8 17.75,8 16.62,9.12 R1.2
USBD-  (via drill 0.35)
  Top 0.152: v25.15,2.7 26.2,2.7 26.2,3.67 25.54,4.33 25.54,5.71 v24.75,6.5
  Bottom 0.152: v24.75,6.5 24.5,6.75 21,6.75 20.5,7.25 19.25,7.25 U1.46 | R2.2 15.5,2.12 16,2.62 16.86,2.62 17.23,2.25 17.23,2.17 17.3,2.1 24.55,2.1 v25.15,2.7
VBAT  (via drill 0.35)
  Top 0.35: CN2.1 29.24,6.09 30.78,6.09 v30.88,6 30.88,7.38 30.51,7.75 29.31,7.75 28.96,8.1 28.96,9.79 28.54,10.21 28.42,10.21 v27.75,10.88
  Bottom 0.152: PS1.1 32.62,16 32.62,16.88 33.88,16.88 34.5,16.25 34.5,16 PS1.3 34.62,15.88 35.5,15.88 35.5,8.5 34.12,7.12 32.12,7.12 31,6 | 31,6 28.75,3.75 C4.2 | 31,6 v30.88,6
  Bottom 0.3: IC2.4 IC2.3 27.6,12.14 | v27.75,10.88 27.75,11.21
  Bottom 0.35: 27.75,11.21 27.75,11.48 27.57,11.65 27.57,12.17 IC2.3

### Text on the board
bPlace: rev1
tNames: Brian Wong, 2023